# Altium schematic sheet Serial.SchDoc
size A4
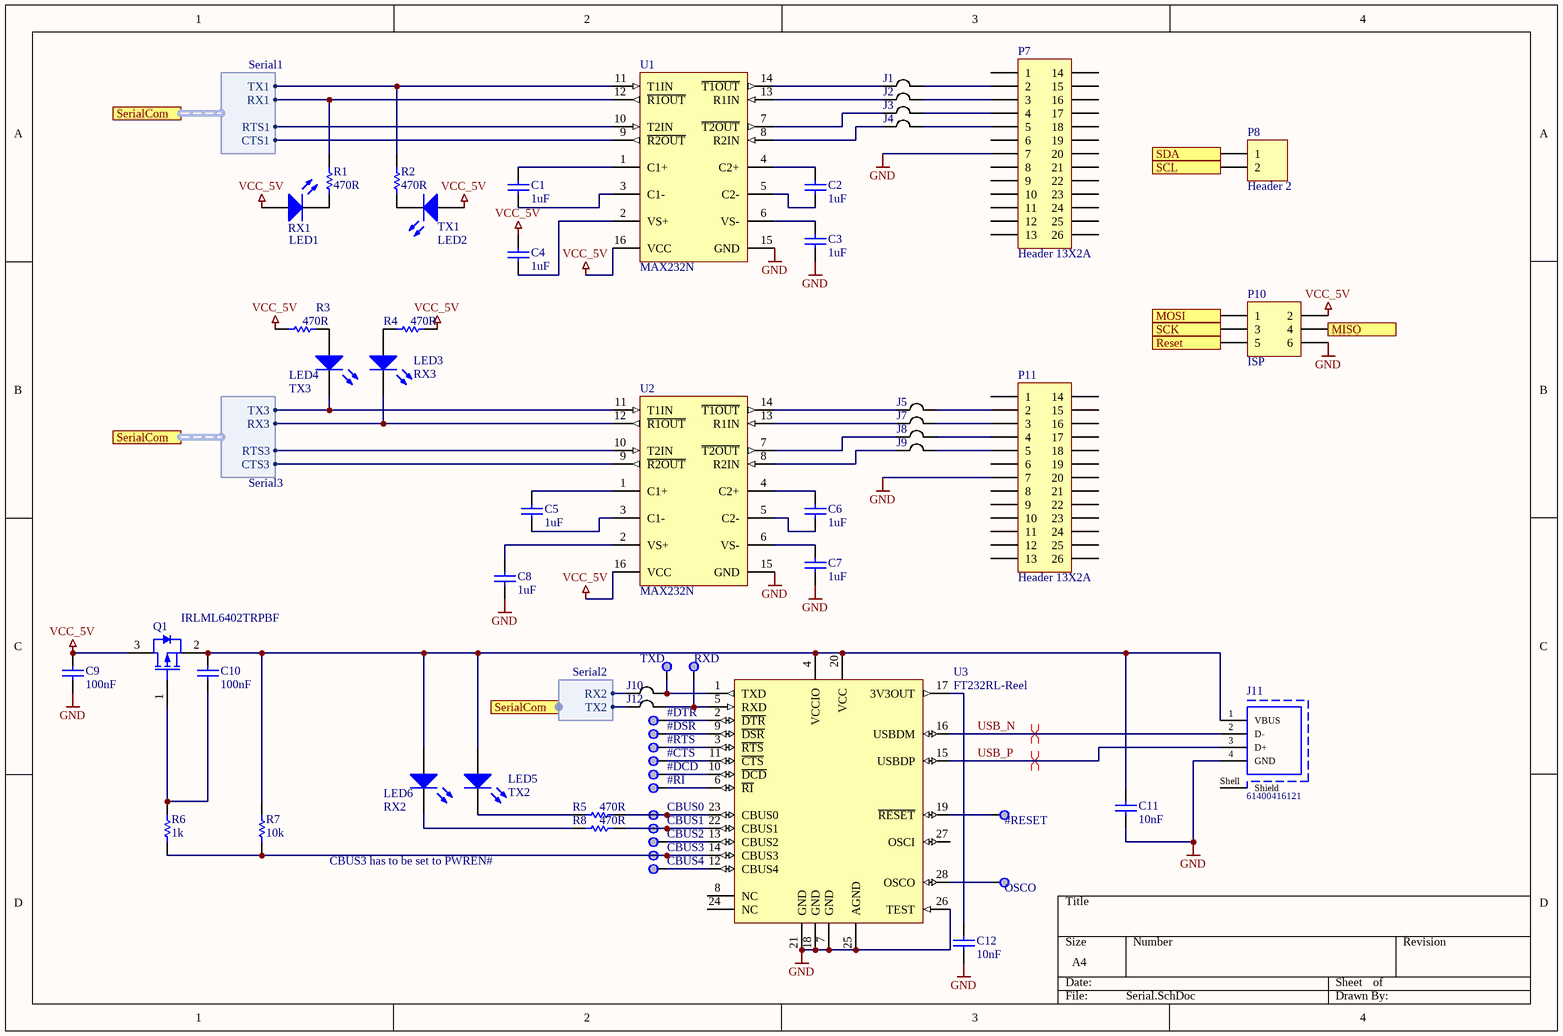
[diagram p0: Serial.SchDoc]

## Parts
#CTS  Testpunkt  [Testpunkt]  (value not drawn)
#DCD  Testpunkt  [Testpunkt]  (value not drawn)
#DSR  Testpunkt  [Testpunkt]  (value not drawn)
#DTR  Testpunkt  [Testpunkt]  (value not drawn)
#RESET  Testpunkt  [Testpunkt]  (value not drawn)
#RI  Testpunkt  [Testpunkt]  (value not drawn)
#RTS  Testpunkt  [Testpunkt]  (value not drawn)
C1  1uF  [CAPC0805(2012)100_M]
C2  1uF  [CAPC0805(2012)100_M]
C3  1uF  [CAPC0805(2012)100_M]
C4  1uF  [CAPC0805(2012)100_M]
C5  1uF  [CAPC0805(2012)100_M]
C6  1uF  [CAPC0805(2012)100_M]
C7  1uF  [CAPC0805(2012)100_M]
C8  1uF  [CAPC0805(2012)100_M]
C9  100nF  [CAPC0805(2012)100_M]
C10  100nF  [CAPC0805(2012)100_M]
C11  10nF  [CAPC0805(2012)100_M]
C12  10nF  [CAPC0805(2012)100_M]
CBUS0  Testpunkt  [Testpunkt]  (value not drawn)
CBUS1  Testpunkt  [Testpunkt]  (value not drawn)
CBUS2  Testpunkt  [Testpunkt]  (value not drawn)
CBUS3  Testpunkt  [Testpunkt]  (value not drawn)
CBUS4  Testpunkt  [Testpunkt]  (value not drawn)
J1  Jumper  [SMDJumper]  (value not drawn)
J2  Jumper  [SMDJumper]  (value not drawn)
J3  Jumper  [SMDJumper]  (value not drawn)
J4  Jumper  [SMDJumper]  (value not drawn)
J5  Jumper  [SMDJumper]  (value not drawn)
J7  Jumper  [SMDJumper]  (value not drawn)
J8  Jumper  [SMDJumper]  (value not drawn)
J9  Jumper  [SMDJumper]  (value not drawn)
J10  Jumper  [SMDJumper]  (value not drawn)
J11  61400416121  [61400416121]
J12  Jumper  [SMDJumper]  (value not drawn)
LED1  RX1  [1206_A]
LED2  TX1  [1206_A]
LED3  RX3  [1206_A]
LED4  TX3  [1206_A]
LED5  TX2  [1206_A]
LED6  RX2  [1206_A]
OSCO  Testpunkt  [Testpunkt]  (value not drawn)
P7  Header 13X2A  [HDR2X13_CEN]
P8  Header 2  [HDR1X2]
P10  ISP  [HDR2X3]
P11  Header 13X2A  [HDR2X13_CEN]
Q1  IRLML6402TRPBF  [INTR-SOT-23-3_V]
R1  470R  [RESC0805(2012)_M]
R2  470R  [RESC0805(2012)_M]
R3  470R  [RESC0805(2012)_M]
R4  470R  [RESC0805(2012)_M]
R5  470R  [RESC0805(2012)_M]
R6  1k  [RESC0805(2012)_M]
R7  10k  [RESC0805(2012)_M]
R8  470R  [RESC0805(2012)_M]
RXD  Testpunkt  [Testpunkt]  (value not drawn)
TXD  Testpunkt  [Testpunkt]  (value not drawn)
U1  MAX232N  [N0016A]
U2  MAX232N  [N0016A]
U3  FT232RL-Reel  [SSOP-28_M]

## Ports
MISO, MOSI, Reset, SCK, SCL, SDA, SerialCom (harness Serial1), SerialCom (harness Serial2), SerialCom (harness Serial3)

## Harnesses
Serial1: TX1, RX1, CTS1, RTS1
Serial2: TX2, RX2
Serial3: TX3, RX3, CTS3, RTS3

## Nets
GND: C3.2 C7.2 C8.2 C9.2 C11.2 C12.2 J11.4(GND) P7.7 P10.6 P11.7 U1.15(GND) U2.15(GND) U3.7(GND) U3.18(GND) U3.21(GND) U3.25(AGND) U3.26(TEST)
VCC_5V: C4.1 C9.1 LED1.2(A) LED2.2(A) P10.2 Q1.3(DRAIN) R3.1 R4.2 U1.16(VCC) U2.16(VCC)
MISO: P10.4 ; port MISO
MOSI: P10.1 ; port MOSI
Reset: P10.5 ; port Reset
SCK: P10.3 ; port SCK
SCL: P8.2 ; port SCL
SDA: P8.1 ; port SDA
USB_N: J11.2(D-) U3.16(USBDM)
USB_P: J11.3(D+) U3.15(USBDP)
Net#CTS_1: #CTS.1 U3.11(~{CTS})
Net#DCD_1: #DCD.1 U3.10(~{DCD})
Net#DSR_1: #DSR.1 U3.9(~{DSR})
Net#DTR_1: #DTR.1 U3.2(~{DTR})
Net#RESET_1: #RESET.1 U3.19(~{RESET})
Net#RI_1: #RI.1 U3.6(~{RI})
Net#RTS_1: #RTS.1 U3.3(~{RTS})
NetC1_1: C1.1 U1.1(C1+)
NetC1_2: C1.2 U1.3(C1-)
NetC2_1: C2.1 U1.4(C2+)
NetC2_2: C2.2 U1.5(C2-)
NetC3_1: C3.1 U1.6(VS-)
NetC4_2: C4.2 U1.2(VS+)
NetC5_1: C5.1 U2.1(C1+)
NetC5_2: C5.2 U2.3(C1-)
NetC6_1: C6.1 U2.4(C2+)
NetC6_2: C6.2 U2.5(C2-)
NetC7_1: C7.1 U2.6(VS-)
NetC8_1: C8.1 U2.2(VS+)
NetC10_1: C10.1 C11.1 J11.1(VBUS) LED5.2(A) LED6.2(A) Q1.2(SOURCE) R7.2 U3.4(VCCIO) U3.20(VCC)
NetC10_2: C10.2 Q1.1(GATE) R6.2
NetC12_1: C12.1 U3.17(3V3OUT)
NetCBUS0_1: CBUS0.1 R5.2 U3.23(CBUS0)
NetCBUS1_1: CBUS1.1 R8.2 U3.22(CBUS1)
NetCBUS2_1: CBUS2.1 U3.13(CBUS2)
NetCBUS3_1: CBUS3.1 R6.1 R7.1 U3.14(CBUS3)
NetCBUS4_1: CBUS4.1 U3.12(CBUS4)
NetJ1_1: J1.1 U1.14(~{T1OUT})
NetJ1_2: J1.2 P7.2
NetJ2_1: J2.1 U1.13(R1IN)
NetJ2_2: J2.2 P7.3
NetJ3_1: J3.1 U1.7(~{T2OUT})
NetJ3_2: J3.2 P7.4
NetJ4_1: J4.1 U1.8(R2IN)
NetJ4_2: J4.2 P7.5
NetJ5_1: J5.1 U2.14(~{T1OUT})
NetJ5_2: J5.2 P11.2
NetJ7_1: J7.1 U2.13(R1IN)
NetJ7_2: J7.2 P11.3
NetJ8_1: J8.1 U2.7(~{T2OUT})
NetJ8_2: J8.2 P11.4
NetJ9_1: J9.1 U2.8(R2IN)
NetJ9_2: J9.2 P11.5
NetJ10_1: J10.1 ; port SerialCom.RX2
NetJ10_2: J10.2 TXD.1 U3.1(TXD)
NetJ12_1: J12.1 ; port SerialCom.TX2
NetJ12_2: J12.2 RXD.1 U3.5(RXD)
NetLED1_1: LED1.1(K) R1.1
NetLED2_1: LED2.1(K) R2.1
NetLED3_1: LED3.1(K) U2.12(~{R1OUT}) ; port SerialCom.RX3
NetLED3_2: LED3.2(A) R4.1
NetLED4_1: LED4.1(K) U2.11(T1IN) ; port SerialCom.TX3
NetLED4_2: LED4.2(A) R3.2
NetLED5_1: LED5.1(K) R5.1
NetLED6_1: LED6.1(K) R8.1
NetOSCO_1: OSCO.1 U3.28(OSCO)
NetR1_2: R1.2 U1.12(~{R1OUT}) ; port SerialCom.RX1
NetR2_2: R2.2 U1.11(T1IN) ; port SerialCom.TX1
NetU1_9: U1.9(~{R2OUT}) ; port SerialCom.CTS1
NetU1_10: U1.10(T2IN) ; port SerialCom.RTS1
NetU2_9: U2.9(~{R2OUT}) ; port SerialCom.CTS3
NetU2_10: U2.10(T2IN) ; port SerialCom.RTS3

Not connected (* = marked no-connect by the designer): J11 Shell(Shield); P7 1 6 8 9 10 11 12 13 14 15 16 17 18 19 20 21 22 23 24 25 26; P11 1 6 8 9 10 11 12 13 14 15 16 17 18 19 20 21 22 23 24 25 26; U3 8(NC) 24(NC) 27(OSCI)

## Layout directives
differential pair; net class USB_N: USB_N
differential pair: USB_P

## Notes on the sheet
- CBUS3 has to be set to PWREN#

## Library data of the parts
C1-C8 = CMP-1036-04754-1: CAP 1uF 25V ±10% 0805 (2012 Metric) Thickness 1mm SMD; Case-EIA: 0805; Case-Metric: 2012; Tolerance: Â±10%; Max Thickness: 1 mm; Value: 1uF; Rated Voltage: 25 V; Technology: SMT
C9 C10 = CMP-1036-04754-1: CAP 100nF 25V ±10% 0805 (2012 Metric) Thickness 1mm SMD; Case-EIA: 0805; Case-Metric: 2012; Tolerance: Â±10%; Max Thickness: 1 mm; Value: 100nF; Rated Voltage: 25 V; Technology: SMT
C11 C12 = CMP-1036-04754-1: CAP 10nF 25V ±10% 0805 (2012 Metric) Thickness 1mm SMD; Case-EIA: 0805; Case-Metric: 2012; Tolerance: Â±10%; Max Thickness: 1 mm; Value: 10nF; Rated Voltage: 25 V; Technology: SMT
J11 = CMP-1502-03243-1: USB 2.0 Type B Receptacle WR-COM, Horizontal, THT, with Pads and Pegs; Manufacturer: Wurth Elektronik; Contact Resistance: 20mOhm; Rated Current: 1.5A; Working Voltage: 30VAC; Package Reference: 61400416121; Part Number: 61400416121; Packaging: Tray; Mounting Technology: THT; Gender: Receptacle; Datasheet URL: https://katalog.we-online.de/em/datasheet/61400416121.pdf; Publisher: WurthElektronik; Orientation: Horizontal; Connector Type: USB2.0TypeB; Operating Temperature: -40to105degC; Manufacturer URL: http://www.we-online.de
LED1-LED6 = CMP-1426-00013-1: SMD mono-color Chip LED, WL-SMCW, Red; PartNumber: 150120RS75000; Manufacturer: Wuerth Elektronik; Color: Red; ComponentLink2URL: http://katalog.we-online.com/led/datasheet/150120RS75000.pdf; ComponentLink2Description: Datasheet; ComponentLink1Description: Manufacturer URL; ComponentLink1URL: http://www.we-online.com; PackageReference: 1206_A
P7 P11 = Header 13X2A: Header, 13-Pin, Dual row; LatestRevisionDate: 17-Jul-2002; LatestRevisionNote: Re-released for DXP Platform.; Publisher: Altium Limited
P8 = Header 2: Header, 2-Pin; LatestRevisionDate: 17-Jul-2002; LatestRevisionNote: Re-released for DXP Platform.; Publisher: Altium Limited
P10 = Header 3X2: Header, 3-Pin, Dual row; LatestRevisionDate: 17-Jul-2002; LatestRevisionNote: Re-released for DXP Platform.; Publisher: Altium Limited
Q1 = CMP-2000-04987-1: HEXFET(R) Power P-Channel MOSFET, -20 V, -3.7 A, -55 to 150 degC, 3-Pin SOT-23, RoHS, Tape and Reel; Manufacturer: International Rectifier; Drain-to-Source Voltage [Vdss]: 20V; Rated Power Dissipation: 1.3W; Qg Gate Charge: 8nC; Drain-Source On Resistance-Max: 0.065O; Channel Type: P-Channel; Package Reference: SOT-23-3; Manufacturer URL: http://internationalrectifier.com/; Datasheet URL: http://datasheet.octopart.com/IRLML6402TRPBF-International-Rectifier-datasheet-93882.pdf; Datasheet Version: Feb-05; Package Description: 3-Pin Small Outline Transistor, Body 2.92 x 1.3 mm, Pitch 0.95 mm
R1-R5 R8 = CMP-1013-00473-1: 470R 0.125W 1% 0805 (2012 Metric)  SMD; Case-Metric: 2012; Value: 470.00 Ohm; Case-EIA: 0805; Power: 0.125 W; Technology: SMT; Tolerance: 1 %
R6 = CMP-1013-00473-1: 1k 0.125W 1% 0805 (2012 Metric)  SMD; Case-Metric: 2012; Case-EIA: 0805; Power: 0.125 W; Value: 1k; Technology: SMT; Tolerance: 1 %
R7 = CMP-1013-00473-1: 10k 0.125W 1% 0805 (2012 Metric)  SMD; Case-Metric: 2012; Case-EIA: 0805; Power: 0.125 W; Value: 10k; Technology: SMT; Tolerance: 1 %
U1 U2 = CMP-0299-00084-2: Dual EIA-232 Driver / Receiver, 0 to 70 degC, 16-Pin PDIP (N), Pb-Free (RoHS); Single Supply: TRUE; ICC(Max)(mA): 10; SubFamily: RS-232; Supply Voltage(s)(V): 5; ESD HBM(kV): +/-2; Receivers Per Package: 2; ComponentLink1Description: Manufacturer URL; PackageDescription: 16-Pin Plastic Dual-In-Line Package, Row Spacing 7.62 mm, Pitch 2.54 mm; ComponentLink3Description: Package Specification; DatasheetVersion: SLLS047L; ComponentLink2URL: http://www.ti.com/general/docs/lit/getliterature.tsp?genericPartNumber=MAX232&fileType=pdf; RS-232: TRUE; ComponentLink3URL: http://www.ti.com/litv/pdf/mpdi002c; PackageReference: N0016A; PackageVersion: revE, Dec-2002; ComponentLink1URL: www.ti.com; Drivers Per Package: 2; ComponentLink2Description: Datasheet
U3 = CMP-0078-00029-3: USB UART Asynchronous Serial Data Transfer Chip, 28-pin SSOP, Tape and Reel; Manufacturer: FTDI; PackageVersion: Mar-12; PackageReference: SSOP-28; ComponentLink2Description: Datasheet; DatasheetVersion: ver 2.10, Mar-2012; PackageDescription: 28-Pin Small Outline Package 0.65 mm Pitch; ComponentLink1Description: Manufacturer URL; RevisionNote: DatasheetVersion updated to 2.10 Mar-2012; PartNumber: FT232RL-Reel; ComponentLink1URL: http://www.ftdichip.com/; ComponentLink2URL: http://www.ftdichip.com/Support/Documents/DataSheets/ICs/DS_FT232R.pdf